# EAGLE design NavBoard (EAGLE 7.4.0)
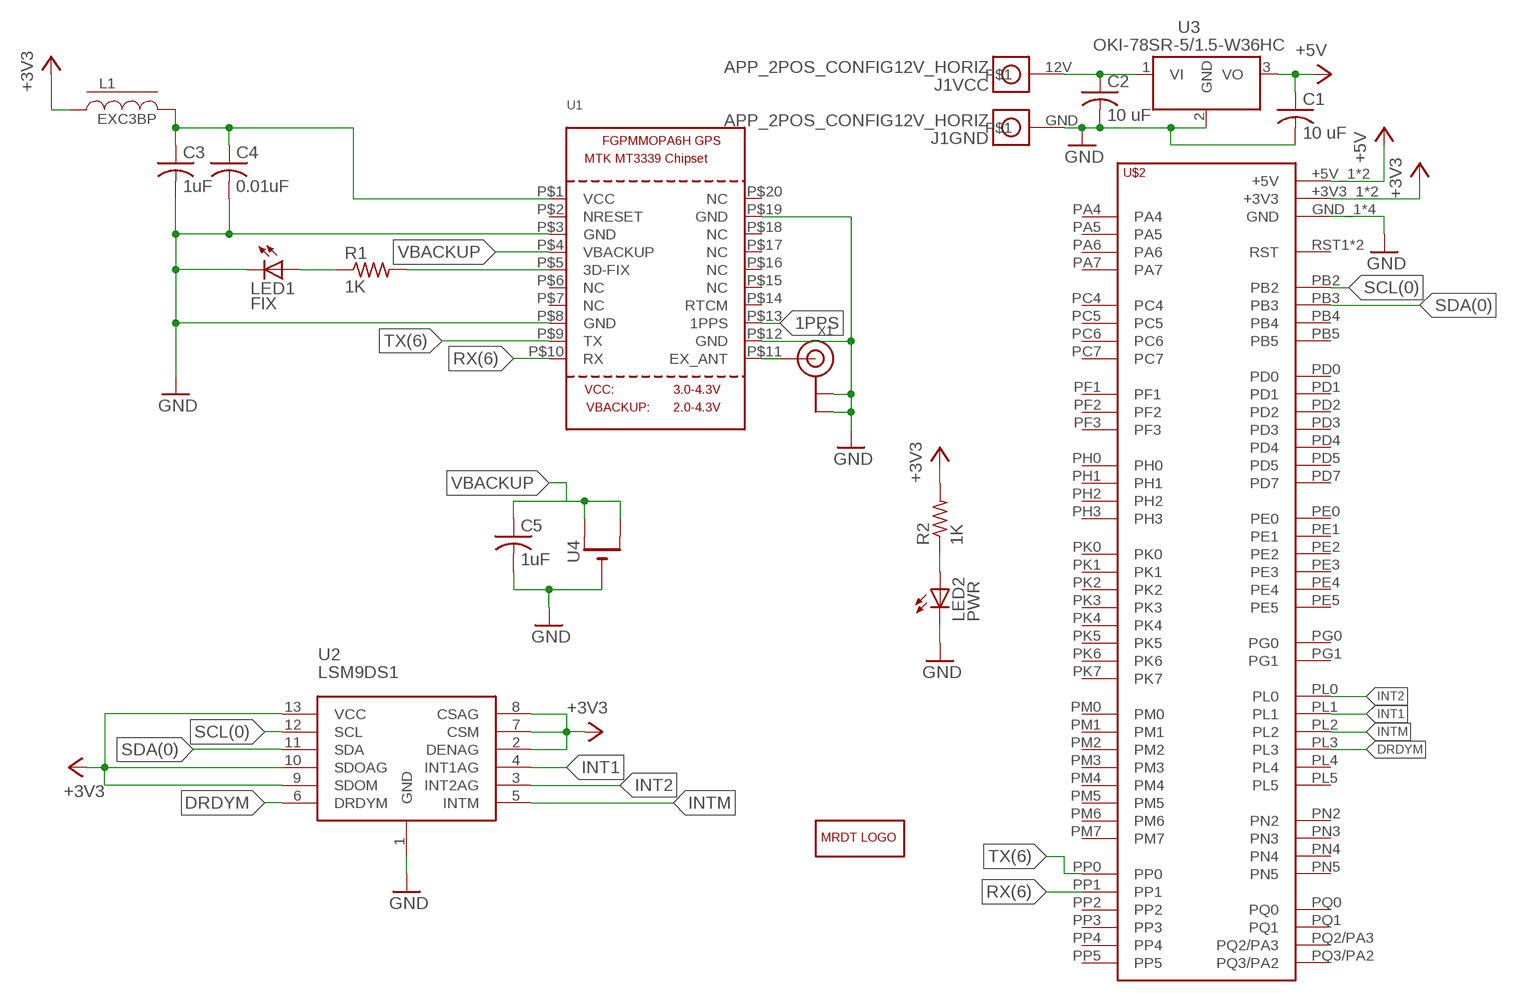
[diagram p0: schematic, sheet 1]

## Parts
C1  10 uF  C-USC1206  [C1206]
C2  10 uF  C-USC1206  [C1206]
C3  1uF  C-USC0805  [C0805]
C4  0.01uF  C-USC0805  [C0805]
C5  1uF  C-USC0805  [C0805]
J1  APP_2POS_CONFIG12V_HORIZ  [APP45_12V_HORIZ_CONFIG]
L1  EXC3BP  [L0603]
LED1  FIX  LEDCHIPLED_0805  [CHIPLED_0805]
LED2  PWR  LEDCHIPLED_0805  [CHIPLED_0805]
LOGO1  MRDT_LOGO  [MRDT_LOGO]
R1  1K  R-US_M0805  [M0805]
R2  1K  R-US_M0805  [M0805]
U1  GPS_FGPMMOPA6H  [FGPMMOPA6H]
U2  LSM9DS1  [LSM9DS1_BREAKOUT]
U3  OKI-78SR-5/1.5-W36HC  [OKI-78SR_HORIZ]
U4  CR1220SMT  [CR1220-SMD]
U$2  TIVA-1294  [TIVA-C-CONNECTED]
X1  ANTENNA_U.FL  [U.FL]

## Nets
1PPS: U1.P$13(1PPS)
+3V3: L1.1 R2.2 U2.2(DENAG) U2.7(CSM) U2.8(CSAG) U2.9(SDOM) U2.10(SDOAG) U2.13(VCC) U$2.+3V3_1(+3V3) U$2.+3V3_2(+3V3)
+5V: C1.1 U3.3(VO) U$2.+5V_1(+5V) U$2.+5V_2(+5V)
DRDYM: U2.6(DRDYM) U$2.PL3
GND: C1.2 C2.2 C3.2 C4.2 C5.2 J1.GND LED1.C LED2.C U1.P$3(GND) U1.P$8(GND) U1.P$12(GND) U1.P$19(GND) U2.1(GND) U3.2(GND) U4.- U$2.GND_1(GND) U$2.GND_2(GND) U$2.GND_3(GND) U$2.GND_4(GND) X1.1(GND) X1.2(GND)
INT1: U2.4(INT1AG) U$2.PL1
INT2: U2.3(INT2AG) U$2.PL0
INTM: U2.5(INTM) U$2.PL2
N$1: C2.1 J1.12V U3.1(VI)
N$2: LED1.A R1.1
N$3: R1.2 U1.P$5(3D-FIX)
N$4: LED2.A R2.1
N$5: U1.P$11(EX_ANT) X1.3(SIGNAL)
N$24: C3.1 C4.1 L1.2 U1.P$1(VCC)
RX(6): U1.P$10(RX) U$2.PP1
SCL(0): U2.12(SCL) U$2.PB2
SDA(0): U2.11(SDA) U$2.PB3
TX(6): U1.P$9(TX) U$2.PP0
VBACKUP: C5.1 U1.P$4(VBACKUP) U4.+$1(+) U4.+$2(+1)
Unconnected: U1.P$2(NRESET) U1.P$6(NC) U1.P$7(NC) U1.P$14(RTCM) U1.P$15(NC) U1.P$16(NC) U1.P$17(NC) U1.P$18(NC) U1.P$20(NC) U$2.PA4 U$2.PA5 U$2.PA6 U$2.PA7 U$2.PB4 U$2.PB5 U$2.PC4 U$2.PC5 U$2.PC6 U$2.PC7 U$2.PD0 U$2.PD1 U$2.PD2 U$2.PD3 U$2.PD4 U$2.PD5 U$2.PD7 U$2.PE0 U$2.PE1 U$2.PE2 U$2.PE3 U$2.PE4 U$2.PE5 U$2.PF1 U$2.PF2 U$2.PF3 U$2.PG0 U$2.PG1 U$2.PH0 U$2.PH1 U$2.PH2 U$2.PH3 U$2.PK0 U$2.PK1 U$2.PK2 U$2.PK3 U$2.PK4 U$2.PK5 U$2.PK6 U$2.PK7 U$2.PL4 U$2.PL5 U$2.PM0 U$2.PM1 U$2.PM2 U$2.PM3 U$2.PM4 U$2.PM5 U$2.PM6 U$2.PM7 U$2.PN2 U$2.PN3 U$2.PN4 U$2.PN5 U$2.PP2 U$2.PP3 U$2.PP4 U$2.PP5 U$2.PQ0 U$2.PQ1 U$2.PQ2/PA3 U$2.PQ3/PA2 U$2.RST1(RST) U$2.RST_2(RST)

## Library data of the parts
C1-C5 = resistor:C-US: CAPACITOR, American symbol
J1 = MRDT-Connectors:APP_2POS_CONFIG; COLOR1: YELLOW; COLOR2: BLACK
L1 = ferrite:EXC3BP: Chip Bead Core
LED1 LED2 = adafruit:LED: LED OSRAM: - CHIPLED LG R971, LG N971, LY N971, LG Q971, LY Q971, LO R971, LY R971 LH N974, LH R974 LS Q976, LO Q976, LY Q976 LO Q996 - Hyper CHIPLED LW Q18S LB Q993, LB Q99A, LB R99A - SideLED LS A670, LO A670, LY A670, LG A670, LP A670 LB A673, LV A673, LT A673, LW A673 LH A674 LY A675 LS A676, LA A676, LO A676, LY A676, LW A676 LS A679, LY A679, LG A679 - Hyper Micro SIDELED® LS Y876, LA Y876, LO Y876, LY Y876 LT Y87S - SmartLED LW L88C, LW L88S LB L89C, LB L89S, LG L890 LS L89K, LO L89K, LY L89K LS L896, LA L896, LO L896, LY L896 - TOPLED LS T670, LO T670, LY T670, LG T670, LP T670 LSG T670, LSP T670, LSY T670, LOP T670, LYG T670 LG T671, LOG T671, LSG T671 LB T673, LV T673, LT T673, LW T673 LH T674 LS T676, LA T676, LO T676, LY T676, LB T676, LH T676, LSB T676, LW T676 LB T67C, LV T67C, LT T67C, LS T67K, LO T67K, LY T67K, LW E67C LS E67B, LA E67B, LO E67B, LY E67B, LB E67C, LV E67C, LT E67C LW T67C LS T679, LY T679, LG T679 LS T770, LO T770, LY T770, LG T770, LP T770 LB T773, LV T773, LT T773, LW T773 LH T774 LS E675, LA E675, LY E675, LS T675 LS T776, LA T776, LO T776, LY T776, LB T776 LHGB T686 LT T68C, LB T68C - Hyper Mini TOPLED® LB M676 - Mini TOPLED Santana® LG M470 LS M47K, LO M47K, LY M47K Source: http://www.osram.convergy.de/
LOGO1 = MRDT-Hardware:MRDT_LOGO
R1 R2 = adafruit:R-US_: RESISTOR, American symbol
U1 = adafruit:GPS_FGPMMOPA6H: GPS Module - MTK MT3339 Chipset, -165dBm sensitivity, 22 channels, 10Hz, auto-select external antenna options
U2 = MRDT-Sensors:LSM9DS1
U3 = MRDT-ICs:OKI-78SR-*/1.5-W36?C: 4.95W DC/DC Converter Manufacturer: Murata; VOUT: +5v
U4 = adafruit:CR1220: CR1216/CR1220/CR1225 12mm 3V lithium coin cell Great for battery packup. Both SMT and THM holders. Note the THM package has the ground pads on both sides of the PCB so that the masks are the same - this reduces the cost
U$2 = MRDT-Microcontrollers:TIVA-1294: TIVA C CONNECTED LAUNCHPAD
X1 = adafruit:ANTENNA_U.FL: U.FL Antenna Connector

## Board
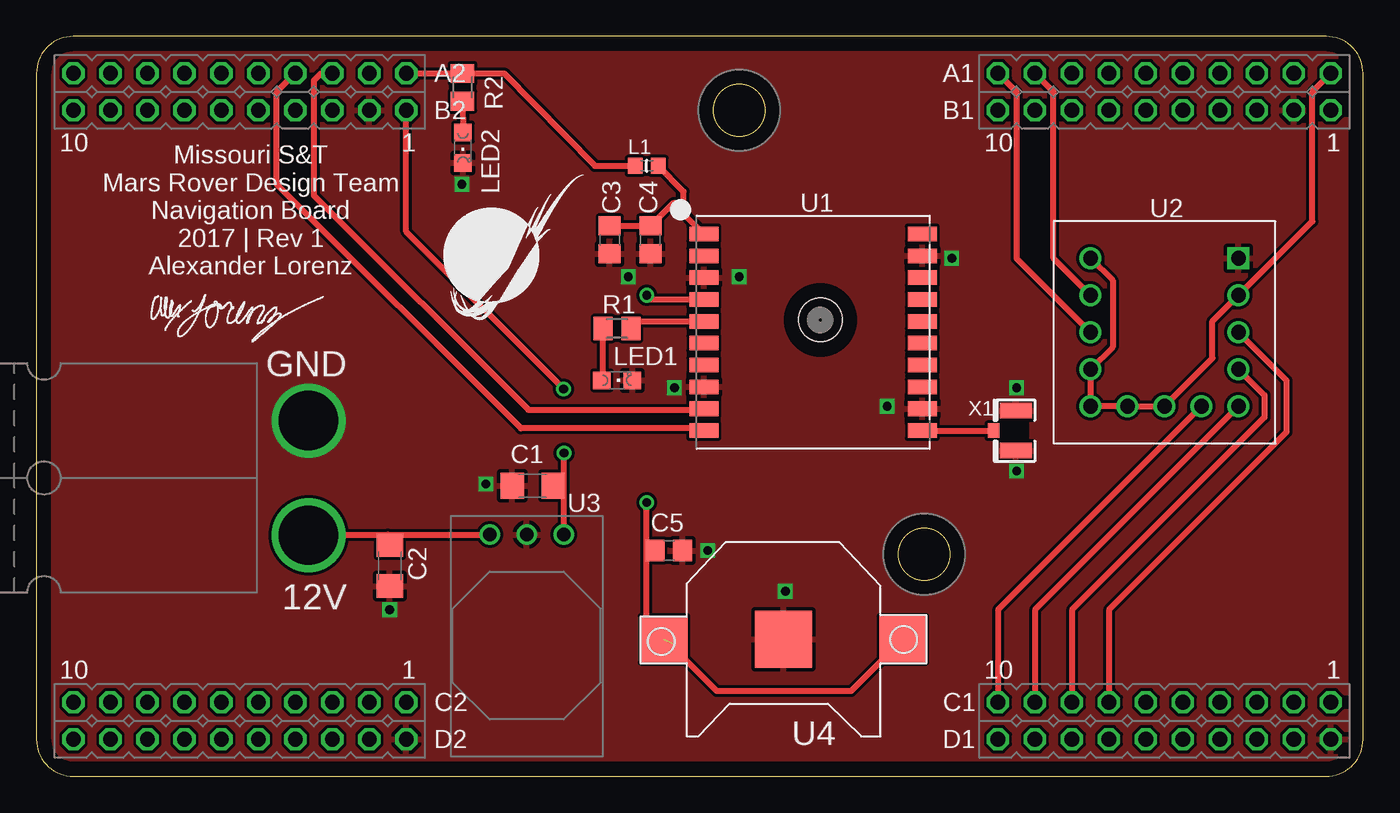
[diagram p1: board, top side]
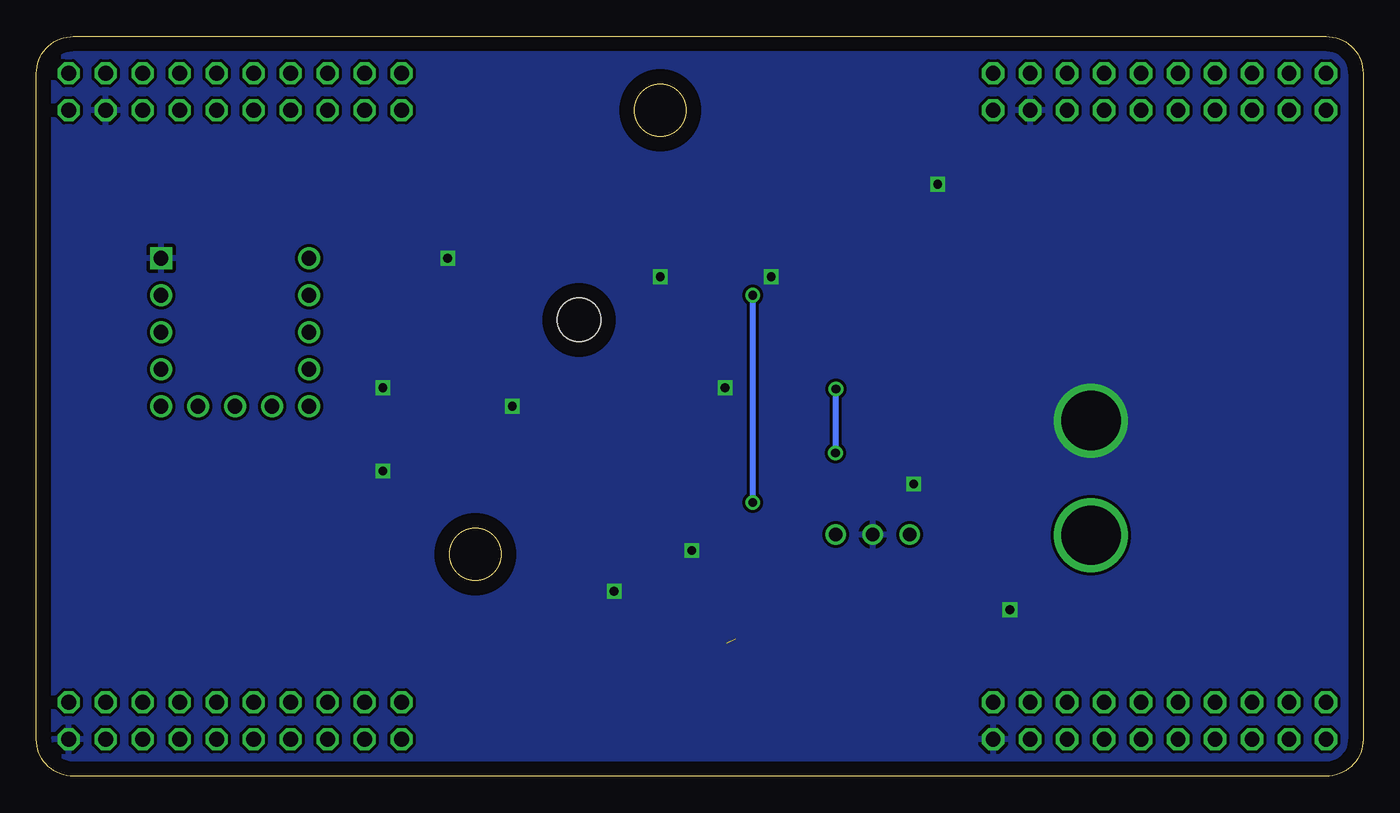
[diagram p2: board, bottom side, seen from below]

Size 91.11 x 50.79 mm. Coordinates in mm from the lower left corner, seen from the top.
Outline: 0,48.25 0,2.54 arc90 2.54,0 88.57,0 arc90 91.11,2.54 91.11,48.25 arc90 88.57,50.79 2.54,50.79 arc90 0,48.25
Copper layers (1*16): Top 0.035mm / dielectric 1.5mm / Bottom 0.035mm
Design rules "default": minimum track width 10mil, minimum drill 24mil, track to track 8mil, track to pad 8mil, pad to pad 8mil, via to via 8mil, smd to smd 8mil, copper to edge 40mil, drill to drill 8mil, minimum pad ring 10mil, minimum via ring 8mil, stop-mask expansion 4mil, vias tented up to drill 0mil, thermal gap 10mil

### Footprints (pad centres in the part's own frame; a part is rotated, then mirrored left to right if it is on the bottom)
C1206 = smd 1.6 x 1.8: 1 -1.4,0; 2 1.4,0
C0805 = smd 1.3 x 1.5: 1 -0.95,0; 2 0.95,0
APP45_12V_HORIZ_CONFIG = drill 4.064: 12V 28.194,3.937; GND 28.194,11.811
L0603 = smd 1 x 1.1: 1 -0.794,0; 2 0.794,0
CHIPLED_0805 = smd 1.2 x 1.2: A 0,-1.05; C 0,1.05
M0805 = smd 1.3 x 1.6: 1 -0.95,0; 2 0.95,0
FGPMMOPA6H = smd 2 x 1: P$1 -7.5,6.75; P$2 -7.5,5.25; P$3 -7.5,3.75; P$4 -7.5,2.25; P$5 -7.5,0.75; P$6 -7.5,-0.75; P$7 -7.5,-2.25; P$8 -7.5,-3.75; P$9 -7.5,-5.25; P$10 -7.5,-6.75; P$11 7.5,-6.75; P$12 7.5,-5.25; P$13 7.5,-3.75; P$14 7.5,-2.25; P$15 7.5,-0.75; P$16 7.5,0.75; P$17 7.5,2.25; P$18 7.5,3.75; P$19 7.5,5.25; P$20 7.5,6.75 | hole 3: 0.5,0.85
LSM9DS1_BREAKOUT = drill 1 square: 1 5.08,5.08 | drill 1: 2 5.08,2.54; 3 5.08,0; 4 5.08,-2.54; 5 5.08,-5.08; 6 2.54,-5.08; 7 0,-5.08; 8 -2.54,-5.08; 9 -5.08,-5.08; 10 -5.08,-2.54; 11 -5.08,0; 12 -5.08,2.54; 13 -5.08,5.08
OKI-78SR_HORIZ = drill 0.9 pad 1.422: 1 0,0; 2 -2.54,0; 3 -5.08,0
CR1220-SMD = smd 3.2 x 3.2: +$1 -8.2,0; +$2 8.2,0 | smd 3.9 x 3.9: - 0,0
TIVA-C-CONNECTED = drill 1.016 octagon: +3V3_1 59.69,54.61; +3V3_2 123.19,54.61; +5V_1 59.69,52.07; +5V_2 123.19,52.07; GND_1 57.15,52.07; GND_2 59.69,8.89; GND_3 120.65,52.07; GND_4 123.19,8.89; PA4 39.37,52.07; PA5 36.83,52.07; PA6 105.41,52.07; PA7 52.07,8.89; PB2 102.87,54.61; PB3 100.33,54.61; PB4 54.61,52.07; PB5 52.07,52.07; PC4 118.11,54.61; PC5 115.57,54.61; PC6 113.03,54.61; PC7 105.41,54.61; PD0 107.95,8.89; PD1 110.49,8.89; PD2 57.15,54.61; PD3 107.95,54.61; PD4 49.53,54.61; PD5 46.99,54.61; PD7 107.95,52.07; PE0 118.11,52.07; PE1 115.57,52.07; PE2 113.03,52.07; PE3 110.49,52.07; PE4 120.65,54.61; PE5 110.49,54.61; PF1 123.19,11.43; PF2 120.65,11.43; PF3 118.11,11.43; PG0 115.57,11.43; PG1 59.69,11.43; PH0 44.45,11.43; PH1 41.91,11.43; PH2 118.11,8.89; PH3 115.57,8.89; PK0 49.53,52.07; PK1 46.99,52.07; PK2 44.45,52.07; PK3 41.91,52.07; PK4 57.15,11.43; PK5 54.61,11.43; PK6 39.37,11.43; PK7 36.83,11.43; PL0 107.95,11.43; PL1 105.41,11.43; PL2 102.87,11.43; PL3 100.33,11.43; PL4 113.03,11.43; PL5 110.49,11.43; PM0 52.07,11.43; PM1 49.53,11.43; PM2 46.99,11.43; PM3 120.65,8.89; PM4 102.87,52.07; PM5 100.33,52.07; PM6 36.83,8.89; PM7 57.15,8.89; PN2 105.41,8.89; PN3 102.87,8.89; PN4 36.83,54.61; PN5 39.37,54.61; PP0 54.61,54.61; PP1 52.07,54.61; PP2 100.33,8.89; PP3 41.91,8.89; PP4 41.91,54.61; PP5 54.61,8.89; PQ0 44.45,54.61; PQ1 39.37,8.89; PQ2/PA3 46.99,8.89; PQ3/PA2 44.45,8.89; RST1 49.53,8.89; RST_2 113.03,8.89
U.FL = smd 2.2 x 1.05: 1 0,1.375; 2 0,-1.375 | smd 0.8 x 1: 3 1.525,0

### Placement (x,y rotation side)
C1  34.08,19.94 180 top
C2  24.27,14.46 270 top
C3  39.37,36.83 270 top
C4  42.16,36.83 270 top
C5  43.43,15.49 0 top
J1  -9.51,12.61 0 top
L1  41.91,41.91 0 top
LED1  39.88,27.18 270 top
LED2  29.29,43.15 180 top
LOGO1  27.94,30.48 0 top
R1  39.88,30.73 0 top
R2  29.26,47.29 90 top
U1  53.34,30.48 0 top
U2  77.47,30.48 0 top
U3  31.14,16.6 180 top
U4  51.31,9.4 180 top
U$1  [SIG]  7.37,28.96 0 top
U$2  -34.29,-6.35 0 top
U$3  [#6_SCREW]  48.26,45.72 0 top
U$4  [#6_SCREW]  60.96,15.24 0 top
X1  67.26,23.73 180 top

### Tracks (layer width: path | path; a pad name or v marks a point on that pad's centre or on a via)
+3V3
  Top 0.406: U$2.+3V3_1 R2.2 32.13,48.26 38.35,41.91 L1.1 | U2.13 73.91,34.04 73.91,29.46 U2.10 U2.9 U2.8 U2.7 80.77,28.7 80.77,31.24 U2.2 87.63,38.1 87.63,46.99 U$2.+3V3_2
+5V  (via drill 0.6)
  Top 0.406: U3.3 36.24,16.62 36.24,20.07 | 36.24,20.07 v36.24,22.19 | v36.2,26.59 25.4,37.39 U$2.+5V_1 | C1.1 arc-45 35.77,20.07 36.24,20.07
  Bottom 0.406: v36.24,22.19 36.2,22.22 v36.2,26.59
DRDYM
  Top 0.406: U2.6 66.04,11.43 U$2.PL3
GND  (via drill 0.6)
  other vias: 46.1,15.49 24.26,11.43 51.44,12.7 43.81,26.67 40.64,34.29 29.21,40.64 67.31,20.95 67.31,26.67 48.26,34.29 62.87,35.56 58.42,25.4 30.86,20.07
  pour Bottom: -1.27,-1.27 -1.27,52.07 92.71,52.07 92.71,-1.27
  pour Top: -2.29,-2.03 -2.29,53.34 93.98,53.34 93.98,-2.03
INT1
  Top 0.406: U2.4 84.33,26.16 84.33,24.64 71.12,11.43 U$2.PL1
INT2
  Top 0.406: U2.3 85.85,27.18 85.85,23.62 73.66,11.43 U$2.PL0
INTM
  Top 0.406: U2.5 68.58,11.43 U$2.PL2
N$1
  Top 0.406: J1.12V 18.73,16.6 24.13,16.6 | 24.13,16.6 U3.1 | C2.1 arc-45 24.13,16.2 24.13,16.6
N$2
  Top 0.406: LED1.A 38.93,27.28 R1.1
N$3
  Top 0.406: R1.2 41.32,31.23 U1.P$5
N$4
  Top 0.406: R2.1 LED2.A
N$5
  Top 0.406: U1.P$11 X1.3
N$24
  Top 0.406: L1.2 44.45,40.13 44.45,39.37 | U1.P$1 44.45,38.62 44.45,39.37 | C3.1 C4.1 43.75,39.37 44.45,39.37
RX(6)
  Top 0.406: U1.P$10 45.69,23.88 33.27,23.88 16.51,40.64 16.51,46.99 U$2.PP1
SCL(0)
  Top 0.406: U2.12 69.85,35.56 69.85,46.99 U$2.PB2
SDA(0)
  Top 0.406: U$2.PB3 67.31,46.99 67.31,35.56 U2.11
TX(6)
  Top 0.406: U$2.PP0 19.56,48.26 19.05,47.75 19.05,39.88 33.78,25.15 46.48,25.15 46.4,25.23 U1.P$9
VBACKUP  (via drill 0.6)  (1 unrouted)
  Top 0.406: v41.91,33.02 42.2,32.73 U1.P$4 | U4.+$2 41.91,10.6 41.91,15.49 | 41.91,15.49 v41.91,18.8 | U4.+$1 55.95,5.84 46.74,5.84 43.69,8.89 43.69,9.14 | C5.1 41.91,15.49
  Bottom 0.406: v41.91,18.8 v41.91,33.02

### Text on the board
tPlace: Missouri S&T / Mars Rover Design Team / Navigation Board / 2017 | Rev 1 / Alexander Lorenz | GND | 12V